# EAGLE design RadioMusic_F (EAGLE 8.1.1)
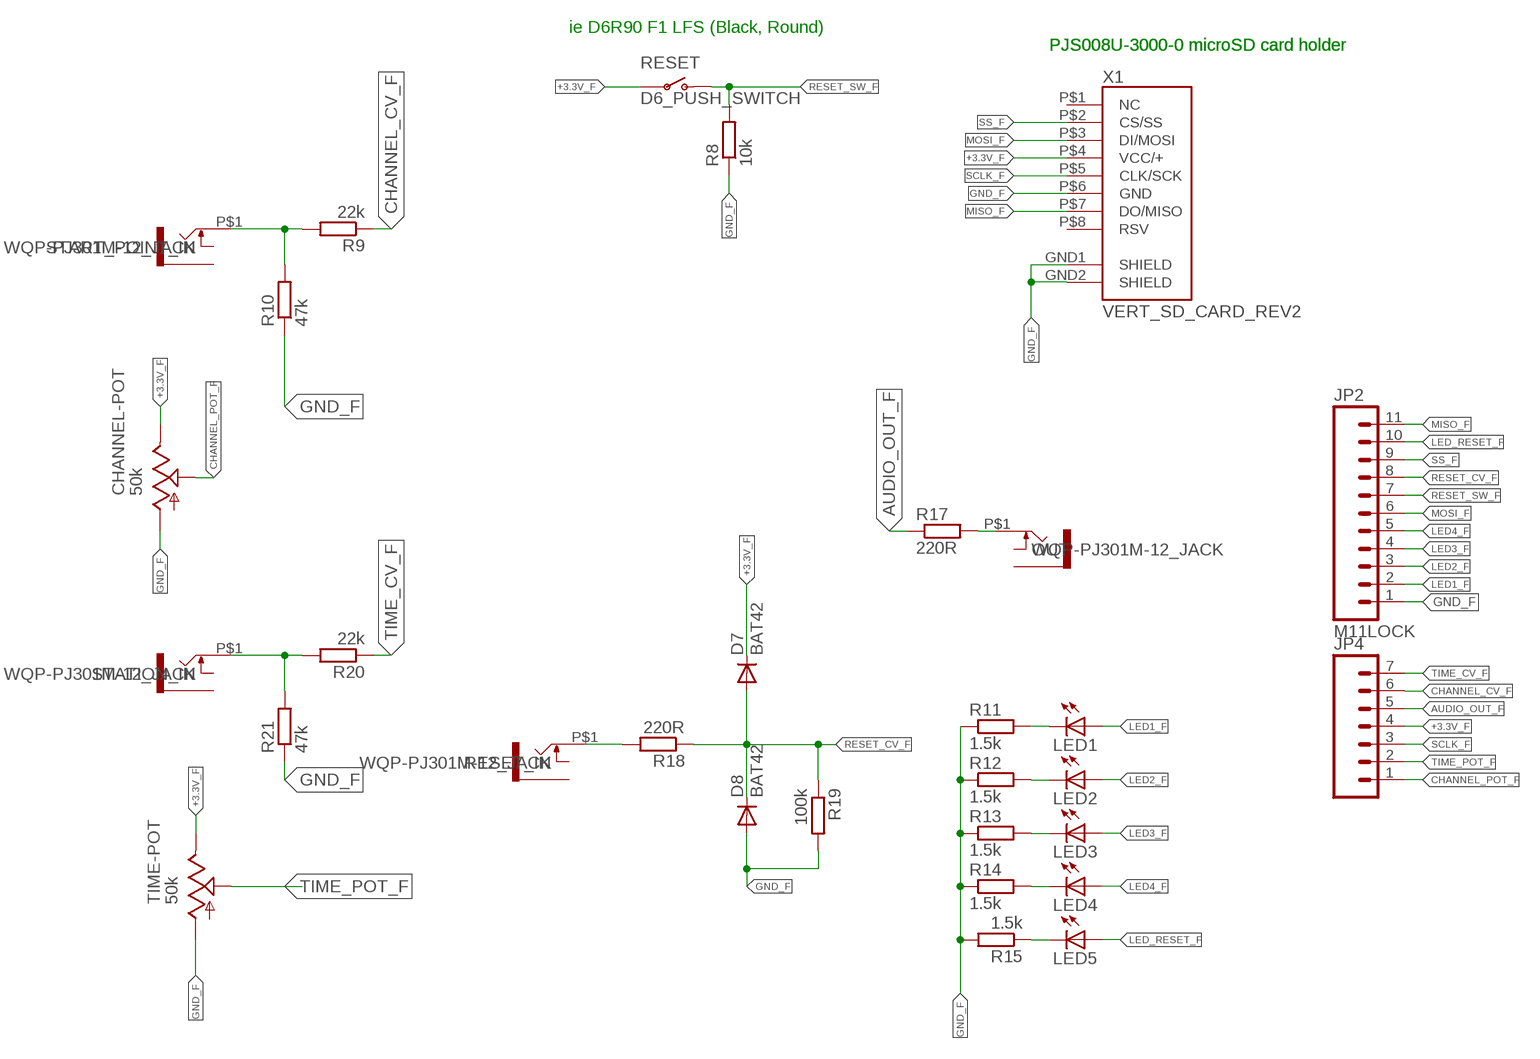
[diagram p0: schematic, sheet 1]

## Parts
CHANNEL-POT  50k  ALPHA-9MMF2A  [EVUF]
D7  BAT42  BAT81  [DO34-7]
D8  BAT42  BAT81  [DO34-7]
JP2  M11LOCK  [1X11_LOCK]
JP4  M07LOCK  [1X07_LOCK]
LED1  LED3MM  [LED3MM]
LED2  LED3MM  [LED3MM]
LED3  LED3MM  [LED3MM]
LED4  LED3MM  [LED3MM]
LED5  LED3MM  [LED3MM]
OUT  WQP-PJ301M-12_JACK  [WQP-PJ301M-12_JACK]
R8  10k  R-EU_STANDARD_RESISTOR  [0207/10]
R9  22k  R-EU_STANDARD_RESISTOR  [0207/10]
R10  47k  R-EU_STANDARD_RESISTOR  [0207/10]
R11  1.5k  R-EU_STANDARD_RESISTOR  [0207/10]
R12  1.5k  R-EU_STANDARD_RESISTOR  [0207/10]
R13  1.5k  R-EU_STANDARD_RESISTOR  [0207/10]
R14  1.5k  R-EU_STANDARD_RESISTOR  [0207/10]
R15  1.5k  R-EU_STANDARD_RESISTOR  [0207/10]
R17  220R  R-EU_STANDARD_RESISTOR  [0207/10]
R18  220R  R-EU_STANDARD_RESISTOR  [0207/10]
R19  100k  R-EU_STANDARD_RESISTOR  [0207/10]
R20  22k  R-EU_STANDARD_RESISTOR  [0207/10]
R21  47k  R-EU_STANDARD_RESISTOR  [0207/10]
RESET  D6_PUSH_SWITCH  [D6_BUTTON_RND]
RESET_IN  WQP-PJ301M-12_JACK  [WQP-PJ301M-12_JACK]
START_POINT_IN  WQP-PJ301M-12_JACK  [WQP-PJ301M-12_JACK]
STATION_IN  WQP-PJ301M-12_JACK  [WQP-PJ301M-12_JACK]
TIME-POT  50k  ALPHA-9MMF2A  [EVUF]
X1  VERT_SD_CARD_REV2  [VERT_MICROSD_REV2]

## Nets
+3.3V_F: CHANNEL-POT.3(E) D7.C JP4.4 RESET.P$3(P) RESET.P$4(P) TIME-POT.3(E) X1.P$4(VCC/+)
AUDIO_OUT_F: JP4.5 R17.1
CHANNEL_CV_F: JP4.6 R9.1
CHANNEL_POT_F: CHANNEL-POT.2(S) JP4.1
GND_F [ground]: CHANNEL-POT.1(A) D8.A JP2.1 R8.1 R10.1 R11.1 R12.1 R13.1 R14.1 R15.2 R19.2 R21.1 TIME-POT.1(A) X1.GND1(SHIELD) X1.GND2(SHIELD) X1.P$6(GND)
LED1_F: JP2.2 LED1.A
LED2_F: JP2.3 LED2.A
LED3_F: JP2.4 LED3.A
LED4_F: JP2.5 LED4.A
LED_RESET_F: JP2.10 LED5.A
MISO_F: JP2.11 X1.P$7(DO/MISO)
MOSI_F: JP2.6 X1.P$3(DI/MOSI)
N$3: OUT.P$1 R17.2
N$9: R9.2 R10.2 START_POINT_IN.P$1
N$14: R18.2 RESET_IN.P$1
N$18: LED1.K(C) R11.2
N$19: LED2.K(C) R12.2
N$20: LED3.K(C) R13.2
N$21: LED4.K(C) R14.2
N$25: LED5.K(C) R15.1
RESET_CV_F: D7.A D8.C JP2.8 R18.1 R19.1
RESET_SW_F: JP2.7 R8.2 RESET.P$1(O) RESET.P$2(O)
SCLK_F: JP4.3 X1.P$5(CLK/SCK)
SS_F: JP2.9 X1.P$2(CS/SS)
TEMP: R20.2 R21.2 STATION_IN.P$1
TIME_CV_F: JP4.7 R20.1
TIME_POT_F: JP4.2 TIME-POT.2(S)
Unconnected: X1.P$1(NC) X1.P$8(RSV)

## Notes on the sheet
- ie D6R90 F1 LFS (Black, Round)
- PJS008U-3000-0 microSD card holder | PJS008U-3000-0 microSD card holder

## Library data of the parts
CHANNEL-POT TIME-POT = TomW:ALPHA-9MM: 9 mm Square Rotary Potentiometers Source: Panasonic
D7 D8 = diode:BAT81: DIODE barrier diode
JP2 = SparkFun-Connectors:M11: Header 11 Standard 11-pin 0.1" header. Use with straight break away headers (SKU : PRT-00116), right angle break away headers (PRT-00553), swiss pins (PRT-00743), machine pins (PRT-00117), and female headers (PRT-00115).
JP4 = SparkFun-Connectors:M07: Header 7 Standard 7-pin 0.1" header. Use with straight break away headers (SKU : PRT-00116), right angle break away headers (PRT-00553), swiss pins (PRT-00743), machine pins (PRT-00117), and female headers (PRT-00115). NOTES ON THE VARIANTS LOCK and LOCK_LONGPADS... This footprint was designed to help hold the alignment of a through-hole component (i.e. 7-pin header) while soldering it into place. You may notice that each hole has been shifted either up or down by 0.005 of an inch from it's more standard position (which is usually a perfectly straight line). This slight alteration caused the pins (the squares in the middle) to touch the edges of the holes. Because they are alternating, it causes a "brace" to hold the header in place. 0.005 has proven to be the perfect amount of "off-center" position when using our standard breakaway headers. Although looks a little odd when you look at the bare footprint, once you have a header in there, the alteration is very hard to notice. Also, if you push a header all the way into place, it is covered up entirely on the bottom side. This idea of altering the position of holes to aid alignment will be further integrated into the Sparkfun Library for other footprints. It can help hold any component with 3 or more connection pins.
LED1-LED5 = TomW:LED: LED OSRAM: - CHIPLED LG R971, LG N971, LY N971, LG Q971, LY Q971, LO R971, LY R971 LH N974, LH R974 LS Q976, LO Q976, LY Q976 LO Q996 - Hyper CHIPLED LW Q18S LB Q993, LB Q99A, LB R99A - SideLED LS A670, LO A670, LY A670, LG A670, LP A670 LB A673, LV A673, LT A673, LW A673 LH A674 LY A675 LS A676, LA A676, LO A676, LY A676, LW A676 LS A679, LY A679, LG A679 - Hyper Micro SIDELED® LS Y876, LA Y876, LO Y876, LY Y876 LT Y87S - SmartLED LW L88C, LW L88S LB L89C, LB L89S, LG L890 LS L89K, LO L89K, LY L89K LS L896, LA L896, LO L896, LY L896 - TOPLED LS T670, LO T670, LY T670, LG T670, LP T670 LSG T670, LSP T670, LSY T670, LOP T670, LYG T670 LG T671, LOG T671, LSG T671 LB T673, LV T673, LT T673, LW T673 LH T674 LS T676, LA T676, LO T676, LY T676, LB T676, LH T676, LSB T676, LW T676 LB T67C, LV T67C, LT T67C, LS T67K, LO T67K, LY T67K, LW E67C LS E67B, LA E67B, LO E67B, LY E67B, LB E67C, LV E67C, LT E67C LW T67C LS T679, LY T679, LG T679 LS T770, LO T770, LY T770, LG T770, LP T770 LB T773, LV T773, LT T773, LW T773 LH T774 LS E675, LA E675, LY E675, LS T675 LS T776, LA T776, LO T776, LY T776, LB T776 LHGB T686 LT T68C, LB T68C - Hyper Mini TOPLED® LB M676 - Mini TOPLED Santana® LG M470 LS M47K, LO M47K, LY M47K Source: http://www.osram.convergy.de LUXEON: - LUMILED® LXK2-PW12-R00, LXK2-PW12-S00, LXK2-PW14-U00, LXK2-PW14-V00 LXK2-PM12-R00, LXK2-PM12-S00, LXK2-PM14-U00 LXK2-PE12-Q00, LXK2-PE12-R00, LXK2-PE12-S00, LXK2-PE14-T00, LXK2-PE14-U00 LXK2-PB12-K00, LXK2-PB12-L00, LXK2-PB12-M00, LXK2-PB14-N00, LXK2-PB14-P00, LXK2-PB14-Q00 LXK2-PR12-L00, LXK2-PR12-M00, LXK2-PR14-Q00, LXK2-PR14-R00 LXK2-PD12-Q00, LXK2-PD12-R00, LXK2-PD12-S00 LXK2-PH12-R00, LXK2-PH12-S00 LXK2-PL12-P00, LXK2-PL12-Q00, LXK2-PL12-R00 Source: www.luxeon.com KINGBRIGHT: KA-3528ASYC Source: www.kingbright.com
OUT RESET_IN START_POINT_IN STATION_IN = thonkiconn:WQP-PJ301M-12_JACK
R8-R15 R17-R21 = TomW:R-EU_: RESISTOR, European symbol
RESET = TomW:D6_PUSH_SWITCH
X1 = TomW:VERT_SD_CARD_REV2

## Net classes
0 default: width 0.305 mm
1 power: width 0.457 mm
2 ground: width 0.457 mm

## Board
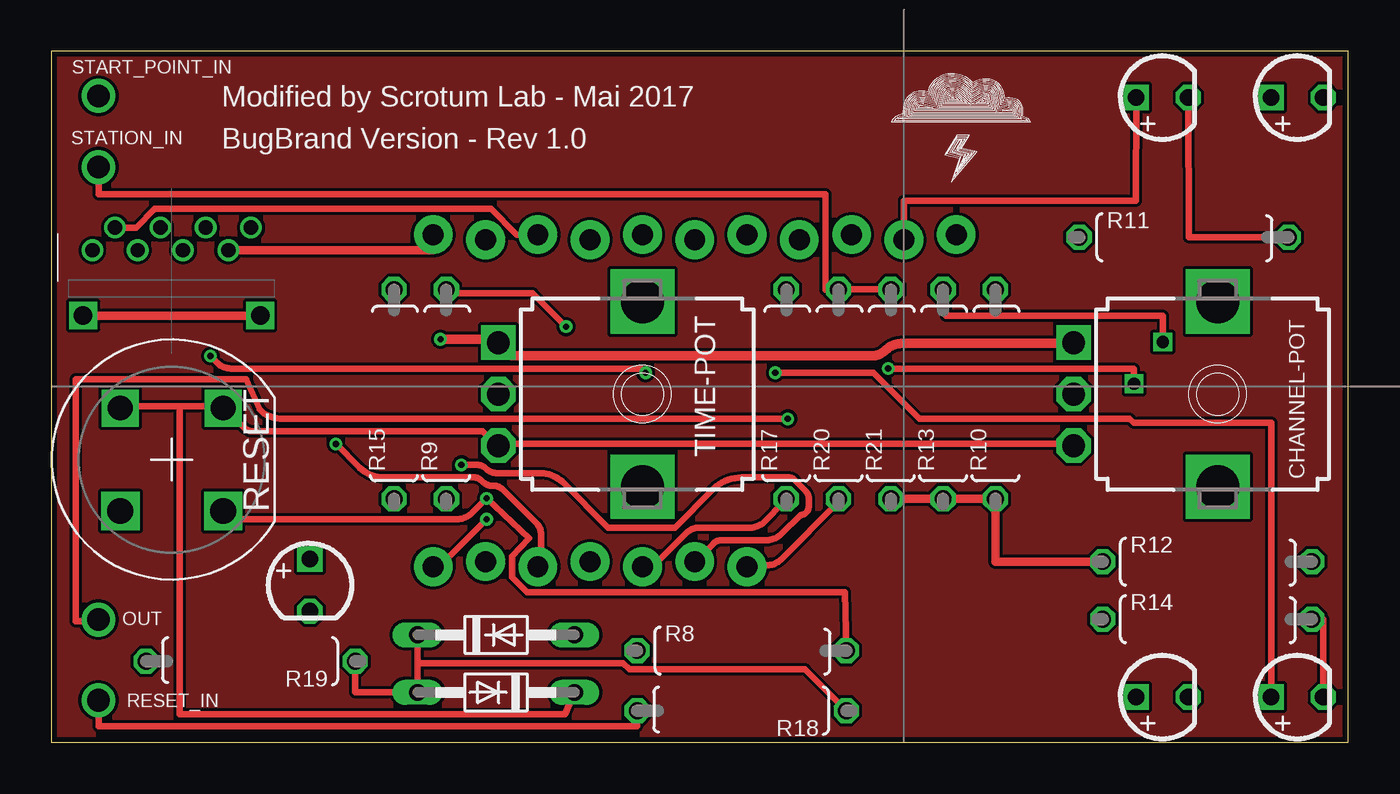
[diagram p1: board, top side]
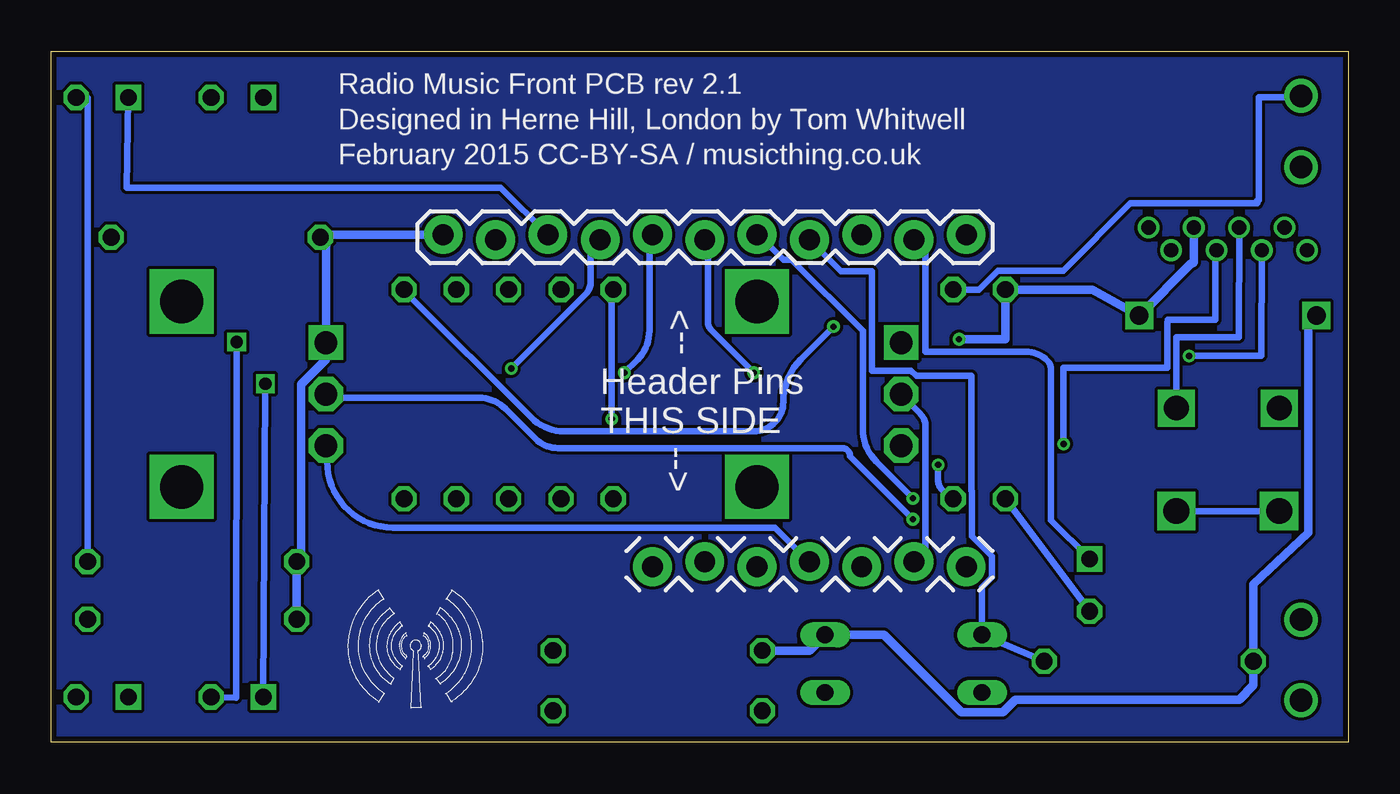
[diagram p2: board, bottom side, seen from below]

Size 62.97 x 33.53 mm. Coordinates in mm from the lower left corner, seen from the top.
Outline: 0,33.53 0,0 62.97,0 62.97,33.53 0,33.53
Copper layers (1*2*15*16): Top 0.035mm / dielectric 0.2mm / Route2 0.0175mm / dielectric 1.1mm / Route15 0.0175mm / dielectric 0.2mm / Bottom 0.035mm
Design rules "SeeedStudio_DRU_no_angle_20130527": minimum track width 6mil, minimum drill 12mil, track to track 6mil, track to pad 6mil, pad to pad 6mil, via to via 6mil, smd to smd 0mil, copper to edge 10mil, drill to drill 10mil, minimum pad ring 6mil, minimum via ring 6mil, stop-mask expansion 2mil, vias tented up to drill 25mil, thermal gap 10mil

### Footprints (pad centres in the part's own frame; a part is rotated, then mirrored left to right if it is on the bottom)
EVUF = drill 1.1 pad 1.676 square: 1 -2.5,-7 | drill 1.1 pad 1.676 octagon: 2 0,-7; 3 2.5,-7 | drill 2.1 pad 2.8 square: M1 4.5,0; M2 -4.5,0
DO34-7 = drill 0.813 long: A 3.81,0; C -3.81,0
1X11_LOCK = drill 1.016 pad 1.88: 1 0,0.127; 2 2.54,-0.127; 3 5.08,0.127; 4 7.62,-0.127; 5 10.16,0.127; 6 12.7,-0.127; 7 15.24,0.127; 8 17.78,-0.127; 9 20.32,0.127; 10 22.86,-0.127; 11 25.4,0.127
1X07_LOCK = drill 1.016 pad 1.88: 1 0,0.127; 2 2.54,-0.127; 3 5.08,0.127; 4 7.62,-0.127; 5 10.16,0.127; 6 12.7,-0.127; 7 15.24,0.127
LED3MM = drill 0.813 square: A -1.27,0 | drill 0.813 octagon: K 1.27,0
WQP-PJ301M-12_JACK = drill 1.1: P$1 0,-0.08
0207/10 = drill 0.813 octagon: 1 -5.08,0; 2 5.08,0
D6_BUTTON_RND = drill 1.245 square: P$1 -2.5,2.5; P$2 2.5,2.5 | drill 1.194 square: P$3 2.5,-2.5; P$4 -2.5,-2.5
VERT_MICROSD_REV2 = drill 0.9 square: GND1 -4.3,-3.17; GND2 4.3,-3.17 | drill 0.7: P$1 -3.85,0; P$2 -2.75,1.1; P$3 -1.65,0; P$4 -0.55,1.1; P$5 0.55,0; P$6 1.65,1.1; P$7 2.75,0; P$8 3.85,1.1

### Placement (x,y rotation side)
CHANNEL-POT  56.64,16.89 270 top
D7  21.59,2.41 180 top
D8  21.59,5.21 0 top
JP2  43.94,24.51 0 bottom
JP4  18.54,8.64 180 bottom
LED1  53.95,31.29 0 top
LED2  60.5,31.29 0 top
LED3  53.95,2.19 0 top
LED4  60.5,2.19 0 top
LED5  12.55,7.62 270 top
OUT  2.2,5.95 90 top
R8  33.53,4.45 0 top
R9  19.17,16.89 90 top
R10  45.84,16.89 90 top
R11  54.99,24.51 0 top
R12  56.13,8.76 0 top
R13  43.3,16.89 90 top
R14  56.13,5.97 0 top
R15  16.63,16.89 90 top
R17  35.68,16.89 90 top
R18  33.53,1.52 180 top
R19  9.68,3.93 180 top
R20  38.22,16.89 90 top
R21  40.76,16.89 90 top
RESET  5.84,13.72 180 top
RESET_IN  2.2,2.03 90 top
START_POINT_IN  2.2,31.37 90 top
STATION_IN  2.2,27.91 90 top
TIME-POT  28.7,16.89 270 top
X1  5.84,23.88 0 top

### Tracks (layer width: path | path; a pad name or v marks a point on that pad's centre or on a via)
+3.3V_F
  Top 0.305: 6.22,16.31 8.33,16.31 RESET.P$4 8.53,16.1 9.39,15.25 arc45 9.77,15.09 20.93,15.09 21.54,14.48 TIME-POT.3 21.74,14.48 49.58,14.48 CHANNEL-POT.3 | 6.22,16.31 3.45,16.31 RESET.P$3 3.25,16.1 | D7.C 24.94,1.35 6.22,1.35 6.22,16.31
  Bottom 0.305: JP4.4 26.21,8.79 27.84,10.41 46.38,10.41 arc90 49.58,13.61 49.58,14.28 CHANNEL-POT.3 | X1.P$4 5.3,19.66 8.33,19.65 8.33,16.23 RESET.P$4
AUDIO_OUT_F
  Top 0.305: R17.1 35.56,11.63 34.62,10.69 arc-45 33.95,10.41 31.48,10.41 arc45 30.81,10.14 29.26,8.59 28.85,8.59 JP4.5
CHANNEL_CV_F  (via drill 0.3)
  Top 0.305: v19.91,13.46 20.67,13.46 arc-45 21.11,13.28 21.11,13.28 arc45 21.65,13.06 23.78,13.06 arc-45 24.81,12.63 27.02,10.41 30.27,10.41 32.13,12.27 arc-45 33.53,12.85 35.79,12.85 arc-45 36.09,12.73 36.65,12.17 arc-45 36.78,11.86 36.78,11.43 arc-90 36.37,11.02 35.46,10.11 arc-45 34.72,9.8 32.54,9.8 arc45 32.14,9.64 31.29,8.79 JP4.6
  Bottom 0.305: v19.91,13.46 19.91,12.75 arc-45 19.7,12.23 19.3,11.84 R9.1
CHANNEL_POT_F  (via drill 0.3)
  Top 0.305: v21.13,10.82 18.89,8.59 18.69,8.59 JP4.1
  Bottom 0.305: v21.13,10.82 24.18,13.87 arc-90 24.58,14.28 38.37,14.28 arc45 39.47,14.73 40.92,16.18 arc-45 42.2,16.71 49.58,16.71 CHANNEL-POT.2
GND
  pour Bottom: -0.2,33.68 62.97,33.68 62.97,0 -0.3,0
  pour Top: 0.11,33.68 62.92,33.68 62.92,-0.06 0.11,-0.06
GND_F  (via drill 0.3)
  Top 0.406: R12.1 45.84,8.76 R10.1 R13.1 R21.1 | X1.GND2 X1.GND1
  Top 0.457: CHANNEL-POT.1 49.58,19.36 41.29,19.36 arc45 40.53,19.04 arc-45 39.81,18.75 22.35,18.75 21.74,19.36 TIME-POT.1 21.54,19.56 v18.89,19.56
  Bottom 0.406: v18.89,19.56 16.63,19.56 R15.2 12.43,21.97 X1.GND2 7.6,23.25 7.53,23.25 7.49,23.29 X1.P$6 | R14.1 R12.1 50.83,8.98 50.83,17.39 49.64,18.58 CHANNEL-POT.1 49.64,24.51 R11.1 49.91,24.64 JP2.1 | R8.1 26.16,4.45 D8.A 22.55,5.21 18.79,1.45 16.77,1.45 16.2,2.01 16.15,2.07 5.28,2.07 4.6,2.75 R19.2 4.6,7.66 1.93,10.17 1.93,20.16 X1.GND1
LED1_F
  Top 0.305: JP2.2 41.4,26.27 52.66,26.27 LED1.A
LED2_F
  Bottom 0.305: JP2.3 41.15,26.92 59.31,26.92 LED2.A
LED3_F  (via drill 0.3, 0.6)
  Top 0.305: v40.64,18.14 52.58,18.14 v52.58,17.4
  Bottom 0.305: v40.64,18.14 37.02,21.76 arc-45 36.78,22.33 36.78,23.82 36.37,24.23 JP2.4 | v52.58,17.4 52.6,17.14 LED3.A
LED4_F  (via drill 0.3)
  Top 0.305: v35.15,17.93 39.91,17.93 42.14,15.7 52.36,15.7 52.55,15.5 59.23,15.5 LED4.A
  Bottom 0.305: v35.15,17.93 34.51,18.57 arc-45 33.93,19.97 33.93,24.64 JP2.5
LED_RESET_F
  Bottom 0.305: JP2.10 20.52,23.82 20.52,18.95 15.64,18.95 arc45 14.61,18.52 arc45 14.42,18.08 14.42,10.77 LED5.A
MISO_F
  Top 0.406: JP2.11 18.54,23.88 X1.P$7
MOSI_F  (via drill 0.3)
  Top 0.305: v7.72,18.75 8.05,18.41 arc45 8.72,18.14 28.65,18.14 v28.85,17.93
  Bottom 0.305: 7.72,18.81 v7.72,18.75 4.22,18.75 X1.P$3 | v28.85,17.93 30.94,20.02 arc45 31.09,20.37 31.09,24.23 JP2.6
N$3  (via drill 0.3)
  Top 0.305: v35.76,15.7 11.21,15.7 arc-45 10.11,16.15 9.45,17.63 1.18,17.63 1.18,5.86 2.22,5.86 OUT.P$1
  Bottom 0.305: v35.76,15.7 35.76,21.79 R17.2
N$9  (via drill 0.3)
  Top 0.305: v24.99,20.17 23.36,21.79 19.3,21.79 R9.2
  Bottom 0.305: v24.99,20.17 26.57,18.59 arc-45 27.43,16.51 arc90 28.86,15.09 38.06,15.09 arc45 39.68,15.76 45.72,21.79 R10.2 | R9.2 17.93,21.97 17.01,22.89 13.84,22.89 10.56,26.16 4.41,26.16 4.41,26.3 4.34,26.3 4.34,31.3 2.28,31.3 START_POINT_IN.P$1
N$14
  Top 0.305: R18.2 28.45,0.76 2.29,0.76 RESET_IN.P$1
N$18
  Top 0.305: LED1.K 55.24,24.51 R11.2
N$19
  Bottom 0.305: LED2.K 61.21,31.29 R12.2
N$20  (via drill 0.6)
  Top 0.305: R13.2 43.43,21.97 43.43,20.7 53.97,20.7 v53.97,19.43
  Bottom 0.305: v53.97,19.43 54,2.16 LED3.K
N$21
  Top 0.305: R14.2 61.77,5.97 LED4.K
N$25
  Bottom 0.305: R15.1 LED5.K
RESET_CV_F
  Top 0.305: R19.1 14.76,2.41 D7.A 17.78,3.83 | 17.78,3.83 D8.C | 17.78,3.83 27.76,3.83 28.07,3.53 36.6,3.53 R18.1
  Bottom 0.305: 23.11,20.15 23.11,18.03 21.23,18.03 20.97,17.78 18.29,17.78 18.29,12.21 18.26,12.19 18.26,9.99 17.3,9.03 17.3,7.99 17.78,7.51 D8.C R19.1 | 23.11,20.15 | 23.11,20.15 23.11,22.86 24.64,22.86 JP2.8
RESET_SW_F  (via drill 0.3)
  Top 0.305: RESET.P$1 8.73,10.82 19.68,10.82 arc45 20.42,11.12 v21.13,11.84 23.19,9.89 22.38,9.03 22.38,7.99 23.1,7.26 38.55,7.26 R8.2
  Bottom 0.305: v21.13,11.84 22.9,13.6 arc45 23.57,15.22 23.57,19.96 27.02,23.42 27.43,23.42 28.65,24.64 JP2.7 | RESET.P$2 RESET.P$1
SCLK_F  (via drill 0.3)
  Top 0.305: v13.81,14.48 14.97,13.32 arc45 16.1,12.85 20.52,12.85 arc-45 20.87,12.71 20.94,12.63 arc45 21.39,12.45 21.48,12.45 arc-45 21.93,12.26 23.54,10.65 arc-45 23.77,10.08 23.77,8.59 JP4.3
  Bottom 0.305: X1.P$5 6.45,23.88 6.45,20.5 8.74,20.5 8.74,20.43 8.79,20.39 8.79,19.84 8.79,19.64 8.79,18.17 13.81,18.17 v13.81,14.48
SS_F
  Top 0.305: JP2.9 22.59,24.64 21.34,25.88 5.02,25.88 4.12,24.98 X1.P$2
TEMP
  Top 0.305: R21.2 40.64,22 38.4,22 R20.2 37.6,21.97 37.6,26.6 2.28,26.6 STATION_IN.P$1
TIME_CV_F
  Top 0.305: R20.1 38.2,11.63 35.45,8.88 arc-45 34.73,8.59 33.93,8.59 JP4.7
TIME_POT_F
  Bottom 0.305: TIME-POT.2 21.54,16.71 20.79,15.96 arc45 20.52,15.32 20.52,9.2 20.93,8.79 JP4.2

### Text on the board
tPlace: Modified by Scrotum Lab - Mai 2017 / BugBrand Version - Rev 1.0
bPlace: Radio Music Front PCB rev 2.1 / Designed in Herne Hill, London by Tom Whitwell / February 2015 CC-BY-SA / musicthing.co.uk | --> | Header Pins / THIS SIDE | -->